# EAGLE design RingShield (EAGLE 9.6.2)
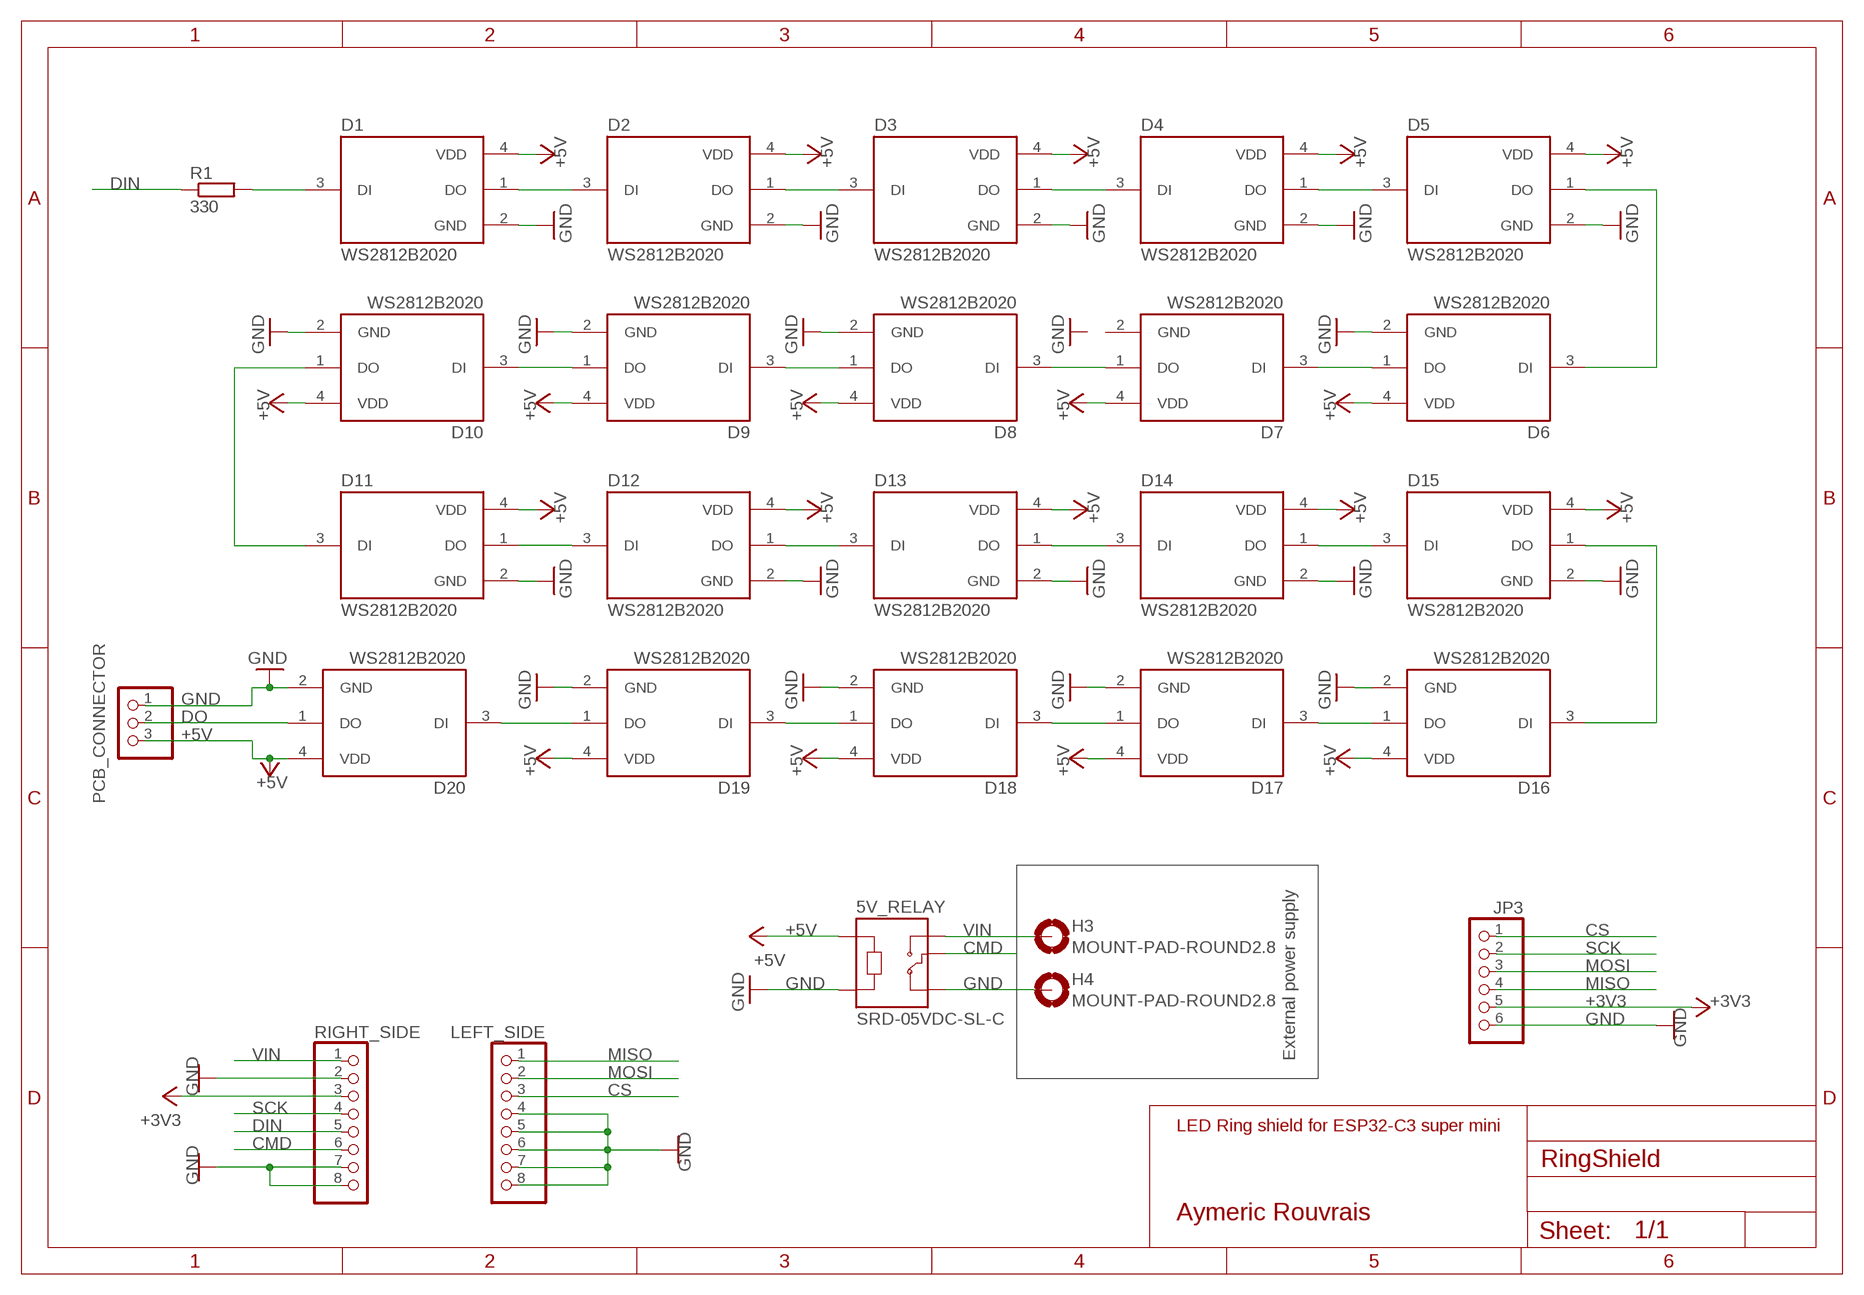
[diagram p0: schematic, sheet 1]

## Parts
5V_RELAY  SRD-05VDC-SL-C  [RELAY_SRD-05VDC-SL-C]
D1  WS2812B2020  [LED_WS2812B2020]
D2  WS2812B2020  [LED_WS2812B2020]
D3  WS2812B2020  [LED_WS2812B2020]
D4  WS2812B2020  [LED_WS2812B2020]
D5  WS2812B2020  [LED_WS2812B2020]
D6  WS2812B2020  [LED_WS2812B2020]
D7  WS2812B2020  [LED_WS2812B2020]
D8  WS2812B2020  [LED_WS2812B2020]
D9  WS2812B2020  [LED_WS2812B2020]
D10  WS2812B2020  [LED_WS2812B2020]
D11  WS2812B2020  [LED_WS2812B2020]
D12  WS2812B2020  [LED_WS2812B2020]
D13  WS2812B2020  [LED_WS2812B2020]
D14  WS2812B2020  [LED_WS2812B2020]
D15  WS2812B2020  [LED_WS2812B2020]
D16  WS2812B2020  [LED_WS2812B2020]
D17  WS2812B2020  [LED_WS2812B2020]
D18  WS2812B2020  [LED_WS2812B2020]
D19  WS2812B2020  [LED_WS2812B2020]
D20  WS2812B2020  [LED_WS2812B2020]
H3  MOUNT-PAD-ROUND2.8  [2,8-PAD]
H4  MOUNT-PAD-ROUND2.8  [2,8-PAD]
JP3  PINHD-1X6/90  [1X06/90]
LEFT_SIDE  PINHD-1X8  [1X08]
PCB_CONNECTOR  PINHD-1X3/90  [1X03/90]
R1  330  R-EU_0204/7  [0204/7]
RIGHT_SIDE  PINHD-1X8  [1X08]

## Nets
+3V3: JP3.5 RIGHT_SIDE.3
+5V: 5V_RELAY.A1 D1.4(VDD) D2.4(VDD) D3.4(VDD) D4.4(VDD) D5.4(VDD) D6.4(VDD) D7.4(VDD) D8.4(VDD) D9.4(VDD) D10.4(VDD) D11.4(VDD) D12.4(VDD) D13.4(VDD) D14.4(VDD) D15.4(VDD) D16.4(VDD) D17.4(VDD) D18.4(VDD) D19.4(VDD) D20.4(VDD) PCB_CONNECTOR.3
CMD: 5V_RELAY.COM RIGHT_SIDE.6
CS: JP3.1 LEFT_SIDE.3
DIN: R1.1 RIGHT_SIDE.5
DO: D20.1(DO) PCB_CONNECTOR.2
GND: 5V_RELAY.A2 5V_RELAY.NC D1.2(GND) D2.2(GND) D3.2(GND) D4.2(GND) D5.2(GND) D6.2(GND) D8.2(GND) D9.2(GND) D10.2(GND) D11.2(GND) D12.2(GND) D13.2(GND) D14.2(GND) D15.2(GND) D16.2(GND) D17.2(GND) D18.2(GND) D19.2(GND) D20.2(GND) H4.B2,8(MOUNT) JP3.6 LEFT_SIDE.4 LEFT_SIDE.5 LEFT_SIDE.6 LEFT_SIDE.7 LEFT_SIDE.8 PCB_CONNECTOR.1 RIGHT_SIDE.2 RIGHT_SIDE.7 RIGHT_SIDE.8
MISO: JP3.4 LEFT_SIDE.1
MOSI: JP3.3 LEFT_SIDE.2
N$1: D1.3(DI) R1.2
N$2: D1.1(DO) D2.3(DI)
N$3: D2.1(DO) D3.3(DI)
N$4: D3.1(DO) D4.3(DI)
N$5: D4.1(DO) D5.3(DI)
N$6: D5.1(DO) D6.3(DI)
N$7: D18.1(DO) D19.3(DI)
N$9: D9.1(DO) D10.3(DI)
N$10: D8.1(DO) D9.3(DI)
N$11: D7.1(DO) D8.3(DI)
N$12: D6.1(DO) D7.3(DI)
N$13: D14.1(DO) D15.3(DI)
N$14: D13.1(DO) D14.3(DI)
N$15: D12.1(DO) D13.3(DI)
N$16: D11.1(DO) D12.3(DI)
N$17: D10.1(DO) D11.3(DI)
N$19: D17.1(DO) D18.3(DI)
N$20: D16.1(DO) D17.3(DI)
N$21: D15.1(DO) D16.3(DI)
N$22: D19.1(DO) D20.3(DI)
SCK: JP3.2 RIGHT_SIDE.4
VIN: 5V_RELAY.NO H3.B2,8(MOUNT) RIGHT_SIDE.1

## Notes on the sheet
- External power supply
- LED Ring shield for ESP32-C3 super mini
- Aymeric Rouvrais

## Power pins joined to a net without a drawn wire
GND: D7.2(GND)

## Library data of the parts
5V_RELAY = SRD-05VDC-SL-C:SRD-05VDC-SL-C: Check availability <https://pricing.snapeda.com/parts/SRD-05VDC-SL-C/Songle%20Relay/view-part?ref=eda>; AVAILABILITY: In Stock; CHECK_PRICES: https://www.snapeda.com/parts/SRD-05VDC-SL-C/Songle+Relay/view-part/?ref=eda; DESCRIPTION: 5V Trigger Relay Module For Arduino And Raspberry Pi 5V Trigger Relay Module For Arduino And Raspberry Pi; MF: Songle Relay; MP: SRD-05VDC-SL-C; PACKAGE: NON STANDARD-5 Songle Relay; PRICE: None; SNAPEDA_LINK: https://www.snapeda.com/parts/SRD-05VDC-SL-C/Songle+Relay/view-part/?ref=snap
D1-D20 = WS2812B2020:WS2812B2020: Check availability <https://pricing.snapeda.com/parts/WS2812B2020/WorldSemi/view-part?ref=eda>; AVAILABILITY: In Stock; CHECK_PRICES: https://www.snapeda.com/parts/WS2812B2020/Worldsemi/view-part/?ref=eda; DESCRIPTION: LED; SMD; 2020; RGB; 2x2x0.84mm; 3.7÷5.3V; Lens: transparent; 2kHz; MF: WorldSemi; MP: WS2812B2020; PACKAGE: None; PRICE: None; SNAPEDA_LINK: https://www.snapeda.com/parts/WS2812B2020/Worldsemi/view-part/?ref=snap
H3 H4 = holes:MOUNT-PAD-ROUND: MOUNTING PAD, round
JP3 = pinhead:PINHD-1X6: PIN HEADER
LEFT_SIDE RIGHT_SIDE = pinhead:PINHD-1X8: PIN HEADER
PCB_CONNECTOR = pinhead:PINHD-1X3: PIN HEADER
R1 = rcl:R-EU_: RESISTOR, European symbol; SPICEPREFIX: R

## Board
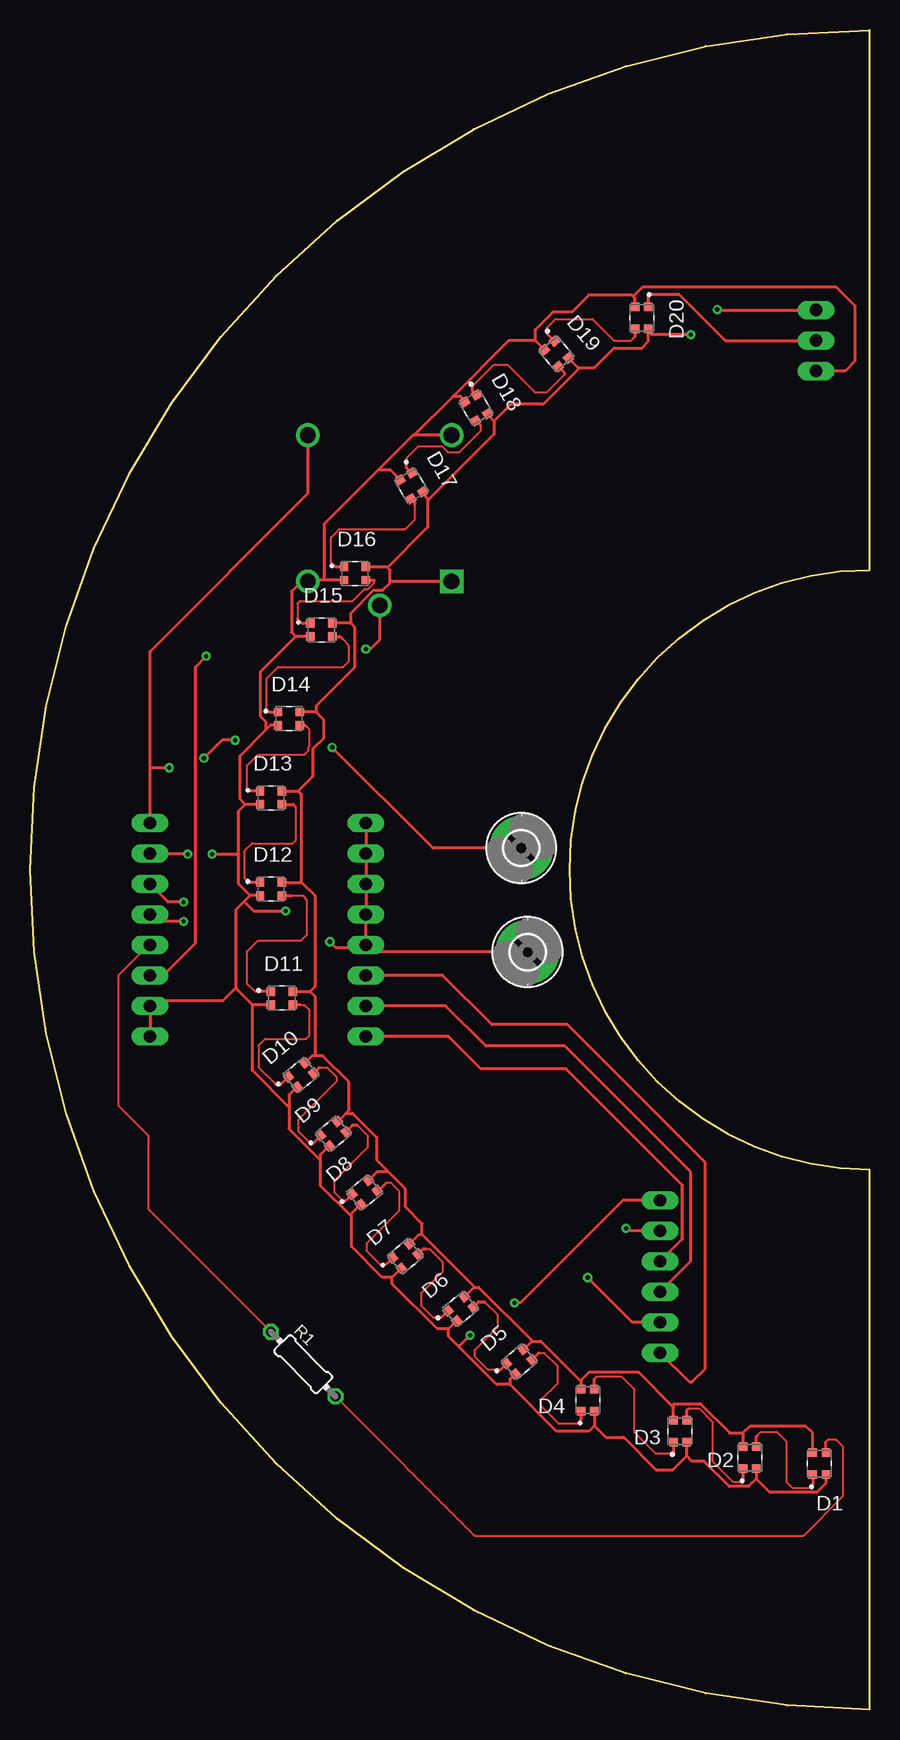
[diagram p1: board, top side]
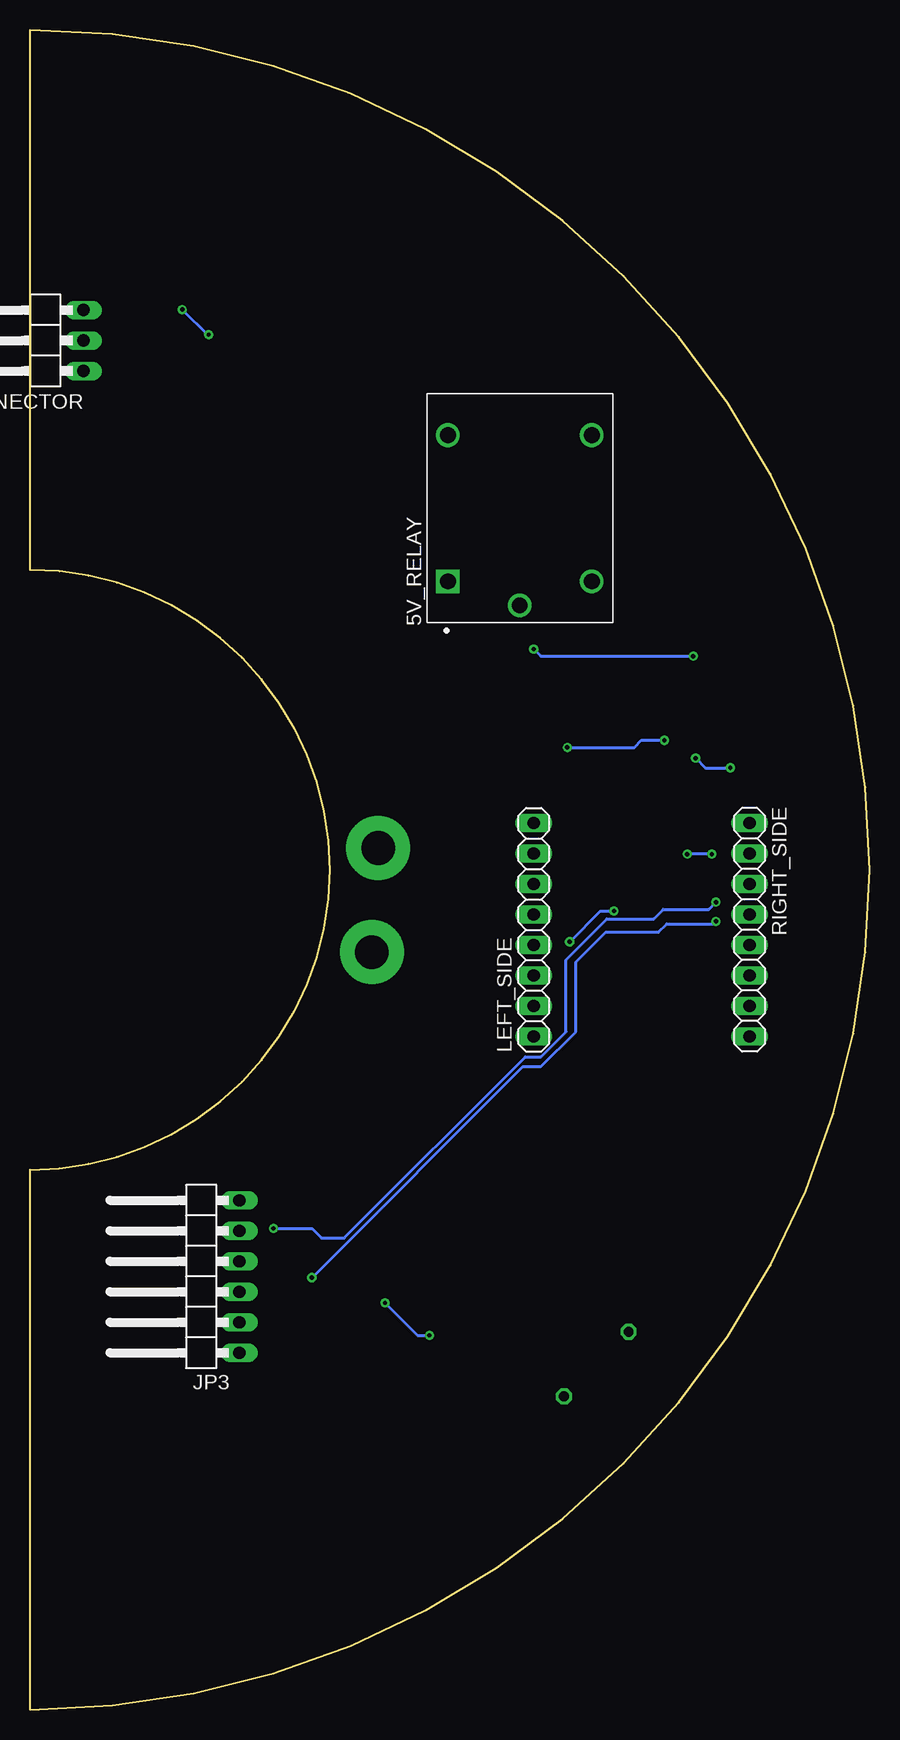
[diagram p2: board, bottom side, seen from below]

Size 70 x 140 mm. Coordinates in mm from the lower left corner, seen from the top.
Outline: 70,45 arc-180 70,95 70,140 arc180 70,0 70,45
Copper layers (1*16): Top 0.035mm / dielectric 1.5mm / Bottom 0.035mm
Design rules "default": minimum track width 6mil, minimum drill 0.35mm, track to track 6mil, track to pad 6mil, pad to pad 6mil, via to via 6mil, smd to smd 6mil, copper to edge 40mil, drill to drill 6mil, minimum pad ring 10mil, minimum via ring 8mil, stop-mask expansion 4mil, vias tented up to drill 0mil, thermal gap 10mil

### Footprints (pad centres in the part's own frame; a part is rotated, then mirrored left to right if it is on the bottom)
RELAY_SRD-05VDC-SL-C = drill 1.32 square: A1 -6.1,6 | drill 1.32: A2 -6.1,-6; NC 6.1,6; NO 6.1,-6 | drill 1.29: COM -8.1,0
LED_WS2812B2020 = smd 0.7 x 0.7: 1 -0.915,0.55; 2 -0.915,-0.55; 3 0.915,-0.55; 4 0.915,0.55
2,8-PAD = drill 2.8 pad 5.334: B2,8 0,0
1X06/90 = drill 1.016 long: 1 -6.35,-3.81; 2 -3.81,-3.81; 3 -1.27,-3.81; 4 1.27,-3.81; 5 3.81,-3.81; 6 6.35,-3.81
1X08 = drill 1.016 long: 1 -8.89,0; 2 -6.35,0; 3 -3.81,0; 4 -1.27,0; 5 1.27,0; 6 3.81,0; 7 6.35,0; 8 8.89,0
1X03/90 = drill 1.016 long: 1 -2.54,-3.81; 2 0,-3.81; 3 2.54,-3.81
0204/7 = drill 0.813 octagon: 1 -3.81,0; 2 3.81,0

### Placement (x,y rotation side)
5V_RELAY  29.16,100.14 90 bottom
D1  65.8,20.5 90 top
D2  60,21 90 top
D3  54.2,23.2 90 top
D4  46.5,25.8 90 top
D5  40.8,29 40 top
D6  35.9,33.4 40 top
D7  31.3,37.8 40 top
D8  27.9,43.1 40 top
D9  25.3,48 40 top
D10  22.6,52.9 40 top
D11  21,59.3 0 top
D12  20.1,68.4 0 top
D13  20.1,76 0 top
D14  21.6,82.6 0 top
D15  24.3,90 0 top
D16  27.1,94.7 0 top
D17  31.8,102 300 top
D18  37.2,108.5 300 top
D19  43.9,113 310 top
D20  51,116 270 top
H3  40.96,71.81 0 top
H4  41.49,63.13 0 top
JP3  56.35,36.09 90 bottom
LEFT_SIDE  28,65 90 bottom
PCB_CONNECTOR  69.35,114.12 90 bottom
R1  22.78,28.79 315 top
RIGHT_SIDE  10,65 270 bottom

### Tracks (layer width: path | path; a pad name or v marks a point on that pad's centre or on a via)
+3V3  (via drill 0.35)
  Top 0.24: JP3.5 50.1,39.9 49.9,40.1 v49.7,40.1 | v12.8,67.3 11.51,67.3 RIGHT_SIDE.3
  Bottom 0.24: v49.7,40.1 46.5,40.1 45.7,39.3 43.8,39.3 28.7,54.4 27.4,54.4 25.3,56.5 25.3,62.5 21.9,65.9 18,65.9 17.2,66.7 13.4,66.7 v12.8,67.3
+5V  (via drill 0.35)
  Top 0.24: D1.4 65.25,23.05 64.7,23.6 60,23.6 59.45,23.05 | 59.45,23.05 D2.4 | D3.4 53.65,25.2 | 53.65,25.2 53.65,25.45 53.7,25.5 55.9,25.5 58.35,23.05 59.45,23.05 | 53.65,25.2 50.75,28.1 46.6,28.1 45.95,27.45 45.95,27.35 | 45.95,27.35 D4.4 | D5.4 41.84,30.7 | 41.84,30.7 42.6,30.7 45.95,27.35 | D6.4 37.04,35.2 | 37.04,35.2 37.4,35.2 41.84,30.76 41.84,30.7 | D7.4 32.44,39.6 32.7,39.6 | 32.7,39.6 37.04,35.26 37.04,35.2 | 32.7,39.6 32.7,40.5 31.3,41.9 31.3,43.4 29.9,44.8 | D8.4 28.94,44.8 29.9,44.8 | D9.4 26.34,49.7 | 29.9,44.8 28.9,45.8 28.9,47.7 26.9,49.7 26.34,49.7 | 26.34,49.7 26.6,49.96 26.6,52.3 24.4,54.5 23.8,54.5 | D10.4 23.54,54.5 23.8,54.5 | 23.8,54.5 23.8,59.4 23.35,59.85 | D11.4 23.35,59.85 | 23.35,59.85 23.8,60.3 23.8,67.8 22.65,68.95 | D12.4 22.65,68.95 | D13.4 22.35,76.55 | 22.65,68.95 22.65,76.25 22.35,76.55 | 22.35,76.55 23.6,77.8 23.6,80.1 24.5,81 24.5,82.5 23.9,83.1 | D14.4 23.85,83.15 23.9,83.1 | 23.9,83.1 23.9,83.7 27.1,86.9 27.1,90.2 26.75,90.55 | 26.75,90.55 D15.4 | 26.75,90.55 26.75,91.38 28.67,93.3 29.4,93.3 30,93.9 30,94 | 30,94 30,95 29.8,95.2 | 29.8,95.2 29.75,95.25 D16.4 | D17.4 32.73,101.38 33.2,100.92 33.2,100.8 | 29.8,95.2 33.2,98.6 33.2,100.8 | 30,94 30.04,94.04 5V_RELAY.A1 | D18.4 38.7,107.42 | 33.2,100.8 38.7,106.3 38.7,107.42 | D19.4 45.7,111.86 | 45.7,111.86 45.7,111.7 42.8,108.8 40.08,108.8 38.7,107.42 | 45.7,111.86 47.06,111.86 48.7,113.5 51,113.5 51.55,114.05 51.55,114.9 | 51.55,114.9 D20.4 | PCB_CONNECTOR.3 65.48,116.6 57.4,116.6 v57.3,116.7 | v55.1,114.6 51.85,114.6 51.55,114.9
  Bottom 0.24: v57.3,116.7 55.2,114.6 v55.1,114.6
CMD  (via drill 0.35)
  Top 0.24: RIGHT_SIDE.6 11.09,61.19 13.8,63.9 13.8,86.9 v14.7,87.8 | 5V_RELAY.COM 29.16,89.16 28.4,88.4 v28,88.4
  Bottom 0.24: v28,88.4 27.4,87.8 v14.7,87.8
CS
  Top 0.24: JP3.1 54.98,27.3 55.2,27.3 56.3,28.4 56.3,45.6 44.8,57.1 38.5,57.1 34.41,61.19 LEFT_SIDE.3
DIN
  Top 0.16: R1.1 9.9,41.67 9.9,47.8 7.4,50.3 7.4,61.23 9.9,63.73 RIGHT_SIDE.5
DO
  Top 0.24: D20.1 51.55,117.95 51.6,118 54.1,118 57.98,114.12 PCB_CONNECTOR.2
GND  (via drill 0.35)
  Top 0.24: RIGHT_SIDE.8 RIGHT_SIDE.7 10.45,59.1 16.1,59.1 17.2,60.2 | LEFT_SIDE.8 LEFT_SIDE.7 LEFT_SIDE.6 LEFT_SIDE.5 LEFT_SIDE.4 | H4.B2,8 28.6,63.13 LEFT_SIDE.4 | RIGHT_SIDE.2 13.1,71.35 v13.15,71.3 | D1.2 66.35,18.85 65.6,18.1 61.7,18.1 60.55,19.25 | D2.2 60.55,19.25 | 60.55,19.25 59.9,18.6 58.3,18.6 56.2,20.7 55.2,20.7 54.75,21.15 | 54.75,21.15 D3.2 | D4.2 47.05,23.65 | 54.75,21.15 53.6,20 52.2,20 49.5,22.7 48,22.7 47.05,23.65 | 47.05,23.65 46.6,23.2 43.9,23.2 40,27.1 | D5.2 40,27.54 40,27.1 | 40,27.1 38.9,27.1 35.7,30.3 | D6.2 34.9,31.74 | 35.7,30.3 34.9,31.1 34.9,31.74 | 34.9,31.74 33.96,31.74 30.2,35.5 30.2,36.04 | D7.2 30.2,36.04 | 30.2,36.04 29.36,36.04 26.8,38.6 26.8,41.1 | 26.8,41.1 26.8,41.34 D8.2 | D9.2 24.2,46.24 24.2,45.8 | 24.2,45.8 24.2,43.7 26.8,41.1 | D10.2 21.6,51.24 21.6,50.2 | 21.6,50.2 21.6,48.4 24.2,45.8 | D11.2 18.55,58.75 | 18.55,58.75 18.5,58.75 18.5,53.3 21.6,50.2 | D12.2 18.35,67.85 | 17.2,60.2 17.2,60.1 18.55,58.75 | 17.2,60.2 17.2,66.7 17.85,67.35 | 17.85,67.35 18.35,67.85 | 18.35,67.85 17.4,68.8 17.4,71.3 | D13.2 17.95,75.45 | 17.4,71.3 17.4,74.9 17.95,75.45 | D14.2 20.05,82.05 19.65,81.65 | 17.95,75.45 17.5,75.9 17.5,79.5 19.65,81.65 | D15.2 22.15,89.45 | 19.65,81.65 19.65,82.35 19.2,82.8 19.2,86.5 22.15,89.45 | 22.15,89.45 21.8,89.8 21.8,93.2 22.64,94.04 5V_RELAY.A2 23.27,94.15 24.5,94.15 | D16.2 24.5,94.15 | D17.2 30.1,103.28 30.1,103.3 29,103.3 | 29,103.3 24.5,98.8 24.5,94.15 | 29,103.3 31.94,106.24 32.04,106.24 | 5V_RELAY.NC 32.04,106.24 | D18.2 36.27,109.12 35.88,109.5 35.3,109.5 | 32.04,106.24 35.3,109.5 | D19.2 42.14,114.1 42.1,114.1 | 35.3,109.5 39.9,114.1 42.1,114.1 | D20.2 50.45,117.65 50.3,117.8
  Top 0.24: 50.3,117.8 50.2,117.9 46.6,117.9 45.2,116.5 43.6,116.5 42.1,115 42.1,114.1 | 50.3,117.8 51.1,118.6 67.2,118.6 68.79,117.01 68.79,112.4 67.97,111.58 PCB_CONNECTOR.1 | v15.2,71.3 17.4,71.3 | LEFT_SIDE.4 27.77,63.5 25.5,63.5 v25,64 | 17.85,67.35 18.65,66.55 v21.3,66.55 | v40.4,33.9 40.9,33.9 49.44,42.44 JP3.6 | 35.7,30.3 35.8,30.3 v36.7,31.2
  Bottom 0.24: v13.15,71.3 v15.2,71.3 | v25,64 22.45,66.55 v21.3,66.55 | v40.4,33.9 37.7,31.2 v36.7,31.2
MISO
  Top 0.24: JP3.4 54.4,39.22 54.4,43.7 44.7,53.4 37.6,53.4 34.89,56.11 LEFT_SIDE.1
MOSI
  Top 0.24: JP3.3 55.1,37.38 55.1,44.8 44.6,55.3 38,55.3 34.65,58.65 LEFT_SIDE.2
N$1
  Top 0.16: R1.2 37.07,14.5 64.5,14.5 67.8,17.8 67.8,21.9 67.22,22.48 66.53,22.48 66.35,22.3
  Top 0.24: D1.3 66.35,22.3
N$2
  Top 0.16: 65.2,18.7 64.95,18.45 63.6,18.45 63.1,18.95 63.1,22.3 62.3,23.1 60.9,23.1 60.6,22.8
  Top 0.24: D1.1 65.25,18.75 65.2,18.7 | D2.3 60.55,22.75 60.6,22.8
N$3
  Top 0.16: 54.9,25.1 55.8,25.1 56.9,24 56.9,20.7 58.6,19 59.3,19
  Top 0.24: D2.1 59.45,19.15 59.3,19 | D3.3 54.75,24.95 54.9,25.1
N$4
  Top 0.16: 53.6,21.3 52.2,21.3 50.4,23.1 50.4,26.7 49.35,27.75 47.25,27.75 47.1,27.6
  Top 0.24: D4.3 47.05,27.55 47.1,27.6 | D3.1 53.65,21.35 53.6,21.3
N$5
  Top 0.16: 45.8,24 45.6,23.8 44.1,23.8 42.6,25.3 42.6,25.8 44,27.2 44,28.6 42.9,29.7 42.5,29.7
  Top 0.24: D4.1 45.95,24.15 45.8,24 | D5.3 42.39,29.7 42.5,29.7
N$6
  Top 0.16: 39,28.3 38.2,28.3 37.1,29.4 37.1,30 39,31.9 39,32.9 37.9,34
  Top 0.24: D5.1 39.21,28.3 39,28.3 | D6.3 37.39,34 37.9,34
N$7
  Top 0.16: 36.9,110.3 38.7,112.1 39.8,112.1 42.1,109.8 43.1,109.8 44.6,111.3
  Top 0.24: D18.1 36.9,109.89 36.9,110.3 | D19.3 44.6,111.41 44.6,111.3
N$9
  Top 0.16: 24.2,53.5 24.8,53.5 25.6,52.7 25.6,52.4 22.4,49.2 22.4,48.2 23.4,47.2
  Top 0.24: D9.1 23.61,47.2 23.4,47.2 | D10.3 24.09,53.5 24.2,53.5
N$10
  Top 0.16: 26.1,42.4 25.4,43.1 25.4,44.1 28.2,46.9 28.2,47.8 27.3,48.7
  Top 0.24: D8.1 26.31,42.4 26.1,42.4 | 27.3,48.7 26.89,48.7 D9.3
N$11
  Top 0.16: 29.81,37.2 29.71,37.1 29.2,37.1 28.05,38.25 28.05,38.85 30.8,41.6 30.8,43.2 30.1,43.9 29.7,43.9 29.5,43.7
  Top 0.24: D7.1 29.81,37.2 | D8.3 29.07,43.27 29.5,43.7
N$12
  Top 0.16: 33,38.4 33.3,38.4 34.4,37.3 34.4,36.5 32.6,34.7 32.6,33.7 33.6,32.7 34.3,32.7
  Top 0.24: D7.3 32.79,38.4 33,38.4 | 34.3,32.7 34.31,32.7 D6.1
N$13
  Top 0.16: 26,89.3 26.6,88.7 26.6,87.4 26.1,86.9 20.7,86.9 19.7,85.9 19.7,83.4
  Top 0.24: D15.3 25.85,89.45 26,89.3 | 19.7,83.4 19.95,83.15 D14.1
N$14
  Top 0.16: 18.1,76.7 18.1,78.7 19,79.6 22.9,79.6 23.25,79.95 23.25,80.25 23.3,80.3 23.3,81.7 23.1,81.9
  Top 0.24: D13.1 18.25,76.55 18.1,76.7 | D14.3 22.95,82.05 23.1,81.9
N$15
  Top 0.16: 18.2,69 17.9,69.3 17.9,71.6 18.5,72.2 21.9,72.2 22.2,72.5 22.2,75.2 22,75.4
  Top 0.24: D12.1 18.25,68.95 18.2,69 | D13.3 21.95,75.45 22,75.4
N$16
  Top 0.16: 19.25,59.85 18.75,59.85 18.1,60.5 18.1,63.2 19,64.1 22.6,64.1 23.1,64.6 23.1,67.5 22.8,67.8 21.8,67.8
  Top 0.24: D11.1 19.25,59.85 | D12.3 21.75,67.85 21.8,67.8
N$17
  Top 0.16: 20.5,52.1 19.1,53.5 19.1,55.4 19.6,55.9 23,55.9 23.3,56.2 23.3,58.3 22.9,58.7 22.6,58.7 22.55,58.75
  Top 0.24: 22.55,58.75 D11.3 | 20.5,52.1 20.91,52.1 D10.1
N$19
  Top 0.16: 31.4,104.1 31.4,104.3 32.4,105.3 34.37,105.3 34.87,104.8 35.8,104.8 37.6,106.6 37.6,107.01
  Top 0.24: D17.1 31.4,103.49 31.4,104.1 | 37.6,107.01 D18.3
N$20
  Top 0.16: 25.3,95.4 25.1,95.6 25.1,97.7 25.8,98.4 31.3,98.4 32.1,99.2 32.1,100.4
  Top 0.24: D16.1 25.45,95.25 25.3,95.4 | D17.3 32.1,100.61 32.1,100.4
N$21
  Top 0.16: 22.3,90.9 22.3,92.2 22.5,92.4 26.9,92.4 27.9,93.4 28.2,93.4 28.7,93.9 28.7,94.1
  Top 0.24: D16.3 28.65,94.15 28.7,94.1 | 22.3,90.9 22.65,90.55 D15.1
N$22
  Top 0.16: 43.1,114.8 43.1,115.2 43.8,115.9 46.9,115.9 48.7,114.1 50.1,114.1 50.3,114.3
  Top 0.24: D19.1 43.1,114.69 43.1,114.8 | D20.3 50.45,114.45 50.3,114.3
SCK  (via drill 0.35)
  Top 0.24: JP3.2 50.22,32.28 v46.5,36 | v12.8,65.7 10.57,65.7 RIGHT_SIDE.4
  Bottom 0.24: v46.5,36 28.9,53.6 27.4,53.6 24.5,56.5 24.5,62.3 22,64.8 17.6,64.8 16.9,65.5 13,65.5 v12.8,65.7
VIN  (via drill 0.35)
  Top 0.16: RIGHT_SIDE.1 10,78.5 10,88.2
  Top 0.24: H3.B2,8 33.59,71.81 v25.2,80.2 | v17.11,80.79 16.01,80.79 15.62,80.4 15.6,80.4 v14.5,79.3 | v11.6,78.5 10,78.5 | RIGHT_SIDE.1 10,88.2 23.16,101.36 5V_RELAY.NO
  Bottom 0.24: v25.2,80.2 19.6,80.2 19.01,80.79 v17.11,80.79 | v14.5,79.3 13.7,78.5 v11.6,78.5